# Altium schematic sheet memory.schdoc
size 292 x 204 mm; Device: A_A4; Symbol: A_A4; Name: A_A4; @Project Name: Odin; REV: 1.0; Date: 2024-09-30; Sheet: 1/1; Draw By: hsinr; Company: Your Company; Convert to PCB: yes; Add into BOM: yes; @Page No: 4; @Page Count: 9; @Schematic Name: Odin; @Board Name: Odin_V1.0.0; @Update Date: 2025-12-12; @Create Time: 14:52:40; @Update Time: 20:43:48; @Page Name: memory; @Create Date: 2025-02-28
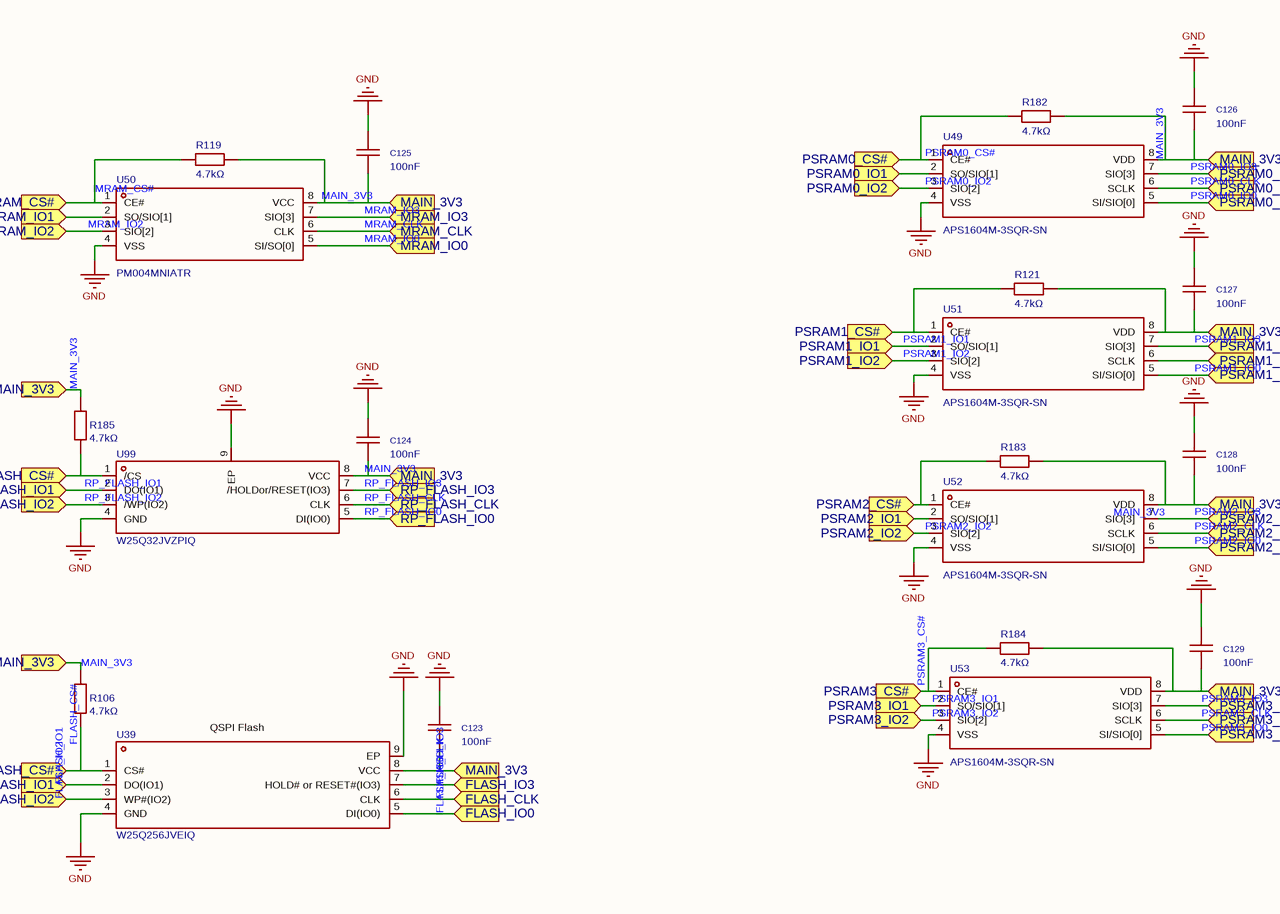
[diagram p0: memory.schdoc]

## Parts
C123  100nF  [C0603]
C124  100nF  [C0603]
C125  100nF  [C0603]
C126  100nF  [C0603]
C127  100nF  [C0603]
C128  100nF  [C0603]
C129  100nF  [C0603]
R106  4.7kΩ  [R0603]
R119  4.7kΩ  [R0603]
R121  4.7kΩ  [R0603]
R182  4.7kΩ  [R0603]
R183  4.7kΩ  [R0603]
R184  4.7kΩ  [R0603]
R185  4.7kΩ  [R0603]
U39  W25Q256JVEIQ  [WSON-8_L8.0-W6.10-P1.27-BL-EP]
U49  APS1604M-3SQR-SN  [SOIC-8_L4.9-W3.9-P1.27-LS6.0-BL]
U50  PM004MNIATR  [SOP-8_L4.9-W3.9-P1.27-LS6.0-BL]
U51  APS1604M-3SQR-SN  [SOIC-8_L4.9-W3.9-P1.27-LS6.0-BL]
U52  APS1604M-3SQR-SN  [SOIC-8_L4.9-W3.9-P1.27-LS6.0-BL]
U53  APS1604M-3SQR-SN  [SOIC-8_L4.9-W3.9-P1.27-LS6.0-BL]
U99  W25Q32JVZPIQ  [WSON-8_L6.0-W5.0-P1.27-BL-EP]

## Ports
FLASH_CLK (in), FLASH_CS# (in), FLASH_IO0 (in), FLASH_IO1 (in), FLASH_IO2 (in), FLASH_IO3 (in), MAIN_3V3 (in), MRAM_CLK (in), MRAM_CS# (in), MRAM_IO0 (in), MRAM_IO1 (in), MRAM_IO2 (in), MRAM_IO3 (in), PSRAM0_CLK (in), PSRAM0_CS# (in), PSRAM0_IO0 (in), PSRAM0_IO1 (in), PSRAM0_IO2 (in), PSRAM0_IO3 (in), PSRAM1_CLK (in), PSRAM1_CS# (in), PSRAM1_IO0 (in), PSRAM1_IO1 (in), PSRAM1_IO2 (in), PSRAM1_IO3 (in), PSRAM2_CLK (in), PSRAM2_CS# (in), PSRAM2_IO0 (in), PSRAM2_IO1 (in), PSRAM2_IO2 (in), PSRAM2_IO3 (in), PSRAM3_CLK (in), PSRAM3_CS# (in), PSRAM3_IO0 (in), PSRAM3_IO1 (in), PSRAM3_IO2 (in), PSRAM3_IO3 (in), RP_FLASH_CLK (in), RP_FLASH_CS# (in), RP_FLASH_IO0 (in), RP_FLASH_IO1 (in), RP_FLASH_IO2 (in), RP_FLASH_IO3 (in)

## Nets
GND: C123.2 C124.2 C125.2 C126.2 C127.2 C128.2 C129.2 U39.4(GND) U39.9(EP) U49.4(VSS) U50.4(VSS) U51.4(VSS) U52.4(VSS) U53.4(VSS) U99.4(GND) U99.9(EP)
FLASH_CLK: U39.6(CLK) ; port FLASH_CLK
FLASH_CS#: R106.1 U39.1(CS#) ; port FLASH_CS#
FLASH_IO0: U39.5(DI(IO0)) ; port FLASH_IO0
FLASH_IO1: U39.2(DO(IO1)) ; port FLASH_IO1
FLASH_IO2: U39.3(WP#(IO2)) ; port FLASH_IO2
FLASH_IO3: U39.7(HOLD#_or_RESET#(IO3)) ; port FLASH_IO3
MAIN_3V3: C123.1 C124.1 C125.1 C126.1 C127.1 C128.1 C129.1 R106.2 R119.2 R121.2 R182.2 R183.2 R184.2 R185.2 U39.8(VCC) U49.8(VDD) U50.8(VCC) U51.8(VDD) U52.8(VDD) U53.8(VDD) U99.8(VCC) ; port MAIN_3V3
MRAM_CLK: U50.6(CLK) ; port MRAM_CLK
MRAM_CS#: R119.1 U50.1(CE#) ; port MRAM_CS#
MRAM_IO0: U50.5(SI/SO[0]) ; port MRAM_IO0
MRAM_IO1: U50.2(SO/SIO[1]) ; port MRAM_IO1
MRAM_IO2: U50.3(SIO[2]) ; port MRAM_IO2
MRAM_IO3: U50.7(SIO[3]) ; port MRAM_IO3
PSRAM0_CLK: U49.6(SCLK) ; port PSRAM0_CLK
PSRAM0_CS#: R182.1 U49.1(CE#) ; port PSRAM0_CS#
PSRAM0_IO0: U49.5(SI/SIO[0]) ; port PSRAM0_IO0
PSRAM0_IO1: U49.2(SO/SIO[1]) ; port PSRAM0_IO1
PSRAM0_IO2: U49.3(SIO[2]) ; port PSRAM0_IO2
PSRAM0_IO3: U49.7(SIO[3]) ; port PSRAM0_IO3
PSRAM1_CLK: U51.6(SCLK) ; port PSRAM1_CLK
PSRAM1_CS#: R121.1 U51.1(CE#) ; port PSRAM1_CS#
PSRAM1_IO0: U51.5(SI/SIO[0]) ; port PSRAM1_IO0
PSRAM1_IO1: U51.2(SO/SIO[1]) ; port PSRAM1_IO1
PSRAM1_IO2: U51.3(SIO[2]) ; port PSRAM1_IO2
PSRAM1_IO3: U51.7(SIO[3]) ; port PSRAM1_IO3
PSRAM2_CLK: U52.6(SCLK) ; port PSRAM2_CLK
PSRAM2_CS#: R183.1 U52.1(CE#) ; port PSRAM2_CS#
PSRAM2_IO0: U52.5(SI/SIO[0]) ; port PSRAM2_IO0
PSRAM2_IO1: U52.2(SO/SIO[1]) ; port PSRAM2_IO1
PSRAM2_IO2: U52.3(SIO[2]) ; port PSRAM2_IO2
PSRAM2_IO3: U52.7(SIO[3]) ; port PSRAM2_IO3
PSRAM3_CLK: U53.6(SCLK) ; port PSRAM3_CLK
PSRAM3_CS#: R184.1 U53.1(CE#) ; port PSRAM3_CS#
PSRAM3_IO0: U53.5(SI/SIO[0]) ; port PSRAM3_IO0
PSRAM3_IO1: U53.2(SO/SIO[1]) ; port PSRAM3_IO1
PSRAM3_IO2: U53.3(SIO[2]) ; port PSRAM3_IO2
PSRAM3_IO3: U53.7(SIO[3]) ; port PSRAM3_IO3
RP_FLASH_CLK: U99.6(CLK) ; port RP_FLASH_CLK
RP_FLASH_CS#: R185.1 U99.1(/CS) ; port RP_FLASH_CS#
RP_FLASH_IO0: U99.5(DI(IO0)) ; port RP_FLASH_IO0
RP_FLASH_IO1: U99.2(DO(IO1)) ; port RP_FLASH_IO1
RP_FLASH_IO2: U99.3(/WP(IO2)) ; port RP_FLASH_IO2
RP_FLASH_IO3: U99.7(/HOLDor/RESET(IO3)) ; port RP_FLASH_IO3

## Notes on the sheet
- (near U39) QSPI Flash
- 1
- 2
- 3
- 4
- 5
- A
- B
- C
- D
- TITLE:
- Odin
- Company:
- Your Company
- Sheet:
- REV:
- 1.0
- 1/1
- Date:
- 2024-09-30
- Drawn By:
- hsinr

## Library data of the parts
C123-C129 = CL10B223KB8NNNC: Capacitance:22nF Tolerance:±10% Tolerance:±10% Voltage Rating:50V Temperature Coefficient:X7R; Manufacturer: SAMSUNG(三星); AddInBom: yes; ModelId: 624118aa3cc7497086c383c2d72e0852; ModelName: C0603_L1.6-W0.8-H0.8; ModelTransform: 62.992,31.496,0,0,0,0,0,0,0; Tolerance: ±10%; Voltage Rating: 50V; Temperature Coefficient: X7R; Symbol: CL10B223KB8NNNC; Value: 100nF; Device: CL10B223KB8NNNC; Supplier: LCSC; Manufacturer Part: CL10B223KB8NNNC; JLCPCB Part Class: Basic Part; LCSC Part Name: 22nF ±10% 50V; Supplier Footprint: 0603; Datasheet: https://item.szlcsc.com/datasheet/CL10B223KB8NNNC/21834.html; ConvertToPcb: yes; FootprintName: C0603
R106 R119 R121 R182-R185 = 4.7kΩ: Manufacturer: YAGEO(国巨); Manufacturer Part: RC0603FR-074K7L; Convert to PCB: yes; Origin Footprint: R0603; Device: 4.7kΩ; Symbol: 4.7kΩ; Supplier: LCSC; Supplier Part: C99782; JLCPCB Part Class: Extended Part; Add into BOM: yes; FootprintName: R0603
U39 = W25Q256JVEIQ_C97522: Interface Type:SPI Memory Size:256Mbit Clock Frequency (fc):133MHz Supply Voltage:2.7V~3.6V Supply Voltage:2.7V~3.6V Page Programming Time (Tpp):700us Block Erase Time (tBE):120ms@(32KB) Data Retention - TDR (Year):20 years Operating Temperature:-40℃~+85℃; Manufacturer: WINBOND(华邦); Symbol: W25Q256JVEIQTR; AddInBom: yes; ModelId: a0f2aa31a7424f6d8e60248ad243c27b; ModelName: WSON-8_L8.0-W6.0-H0.78-P1.27; ModelTransform: 315.7474,236.22,0,90,0,0,0,0,0; Interface Type: SPI; Clock Frequency (fc): 133MHz; Page Programming Time (Tpp): 700us; Device: W25Q256JVEIQ_C97522; LCSC Part Name: W25Q256JVEIQ; SupplierPart: C97522; ManufacturerPart: W25Q256JVEIQ; Supplier Footprint: WSON-8-EP(6x8); JLCPCB Part Class: Extended Part; Datasheet: https://atta.szlcsc.com/upload/public/pdf/source/20190529/C97522_47AE152D0BB11FB4C8509E398C0AD2EA.pdf; Supplier: LCSC; ConvertToPcb: yes; FootprintName: WSON-8_L8.0-W6.10-P1.27-BL-EP; Memory Size: 256Mbit; Supply Voltage: 2.7V~3.6V; Block Erase Time (tBE): 120ms@(32KB); Data Retention - TDR (Year): 20 years; Operating Temperature: -40℃~+85℃
U49 U51-U53 = APS1604M-3SQR-SN_C18214056: Interface:SPI；QPI Memory Size:16Mbit Voltage - Supply:2.7V~3.6V Voltage - Supply:2.7V~3.6V Supply Current (Icc):7mA Standby Current (Iq):0.2mA Operating Temperature:-40℃~+85℃ Operating Temperature:-40℃~+85℃; Manufacturer: Apmemory; AddInBom: yes; ModelId: 2ec1ac1bf9bf4d09a988fcee15e6a02d; ModelName: SOIC-8_L4.9-W3.9-H1.7-LS6.0-P1.27; ModelTransform: 189.751,236.22,0,0,0,0,0.0005,0.0005,0; Memory Size: 16Mbit; Supply Current (Icc): 7mA; Standby Current (Iq): 0.2mA; Symbol: APS1604M-3SQR-SN_C18214056; Device: APS1604M-3SQR-SN_C18214056; LCSC Part Name: SPI/QPI 伪静态随机存取存储器; SupplierPart: C18214056; ManufacturerPart: APS1604M-3SQR-SN; Supplier Footprint: SOP-8; JLCPCB Part Class: Extended Part; Datasheet: https://item.szlcsc.com/datasheet/APS1604M-3SQR-SN/19391224.html; Supplier: LCSC; ConvertToPcb: yes; FootprintName: SOIC-8_L4.9-W3.9-P1.27-LS6.0-BL; Interface: SPI；QPI; Voltage - Supply: 2.7V~3.6V; Operating Temperature: -40℃~+85℃
U50 = PM004MNIATR: Interface:SPI Memory Format:MRAM Memory Size:4Mbit Voltage - Supply:2.7V~3.6V Voltage - Supply:2.7V~3.6V Operating Temperature:-40℃~+85℃ Operating Temperature:-40℃~+85℃; Manufacturer: Siproin(上海矽朋); AddInBom: yes; ModelId: 9e479aa4755a4392b89c401224ad1275; ModelName: SOP-8_L4.9-W3.9-P1.27-LS6.0-BL-1; ModelTransform: 192.913,236.22,0,0,0,0,0,0,0; Interface: SPI; Memory Format: MRAM; Memory Size: 4Mbit; Symbol: PM004MNIATR; Device: PM004MNIATR; LCSC Part Name: PM004MNIATR; SupplierPart: C5444277; ManufacturerPart: PM004MNIATR; Supplier Footprint: SOP-8; JLCPCB Part Class: Extended Part; Datasheet: https://atta.szlcsc.com/upload/public/pdf/source/20230412/571A622A320634CD9B3A3BB9CFEB0AE2.pdf; Supplier: LCSC; ConvertToPcb: yes; FootprintName: SOP-8_L4.9-W3.9-P1.27-LS6.0-BL; Voltage - Supply: 2.7V~3.6V; Operating Temperature: -40℃~+85℃
U99 = W25Q32JVZPIQ: Interface:SPI Memory Size:32Mbit Clock Frequency:133MHz Voltage - Supply:2.7V~3.6V Voltage - Supply:2.7V~3.6V Program / Erase Cycles:100,000 Cycles Page Programming Time (Tpp):3ms Data Retention - TDR (Year):20 Years Operating Temperature:- Operating Temp; Manufacturer: Winbond(华邦); AddInBom: yes; ModelId: dfb5b18473104f55ab3029446c4cfe60; ModelName: WSON-8_L6.0-W5.0-H0.7-P1.27; ModelTransform: 237.007,196.85,0,90,0,0,0,0,0; Interface: SPI; Memory Size: 32Mbit; Clock Frequency: 133MHz; Page Programming Time (Tpp): 3ms; Symbol: W25Q32JVZPIQ; Device: W25Q32JVZPIQ; LCSC Part Name: 支持双线、四线SPI接口的3V、32Mbit 串行SPI闪存; SupplierPart: C571260; ManufacturerPart: W25Q32JVZPIQ; Supplier Footprint: WSON-8-EP(5x6); JLCPCB Part Class: Extended Part; Datasheet: https://item.szlcsc.com/datasheet/W25Q32JVZPIQ/597704.html; Supplier: LCSC; ConvertToPcb: yes; FootprintName: WSON-8_L6.0-W5.0-P1.27-BL-EP; Voltage - Supply: 2.7V~3.6V; Program / Erase Cycles: 100,000 Cycles; Data Retention - TDR (Year): 20 Years; Operating Temperature: -